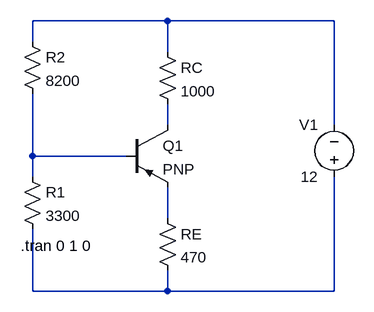
[diagram p0: schematic bipolar_junction_transistor.asc]
bipolar_junction_transistor.asc, the LTspice schematic file:
Version 4
SHEET 1 880 680
WIRE 320 16 112 16
WIRE 576 16 320 16
WIRE 112 48 112 16
WIRE 320 64 320 16
WIRE 320 176 320 144
WIRE 576 176 576 16
WIRE 112 224 112 128
WIRE 256 224 112 224
WIRE 112 256 112 224
WIRE 320 320 320 272
WIRE 112 432 112 336
WIRE 320 432 320 400
WIRE 320 432 112 432
WIRE 576 432 576 256
WIRE 576 432 320 432
SYMBOL pnp 256 176 R0
SYMATTR InstName Q1
SYMBOL res 304 304 R0
SYMATTR InstName RE
SYMATTR Value 470
SYMBOL res 304 48 R0
SYMATTR InstName RC
SYMATTR Value 1000
SYMBOL voltage 576 272 R180
WINDOW 0 24 96 Left 2
WINDOW 3 24 16 Left 2
WINDOW 123 0 0 Left 0
WINDOW 39 0 0 Left 0
SYMATTR InstName V1
SYMATTR Value 12
SYMBOL res 96 240 R0
SYMATTR InstName R1
SYMATTR Value 3300
SYMBOL res 96 32 R0
SYMATTR InstName R2
SYMATTR Value 8200
TEXT 94 362 Left 2 !.tran 0 1 0

The netlist it stands for:
* bipolar_junction_transistor.asc
Q1 N002 N003 N004 0 PNP
RE N004 N005 470
RC N001 N002 1000
V1 N005 N001 12
R1 N003 N005 3300
R2 N001 N003 8200
.model NPN NPN
.model PNP PNP
.lib standard.bjt
.tran 0 1 0
.backanno
.end